# Altium schematic sheet LED_DRIVE.SchDoc
size A3; ApprovedBy: D. Grossman; CheckedBy: G. Engel; Author: Y. Yakov; CompanyName: LightSense; DrawnBy: Y. Yakov; Engineer: Y.Yakov; Organization: LightSense
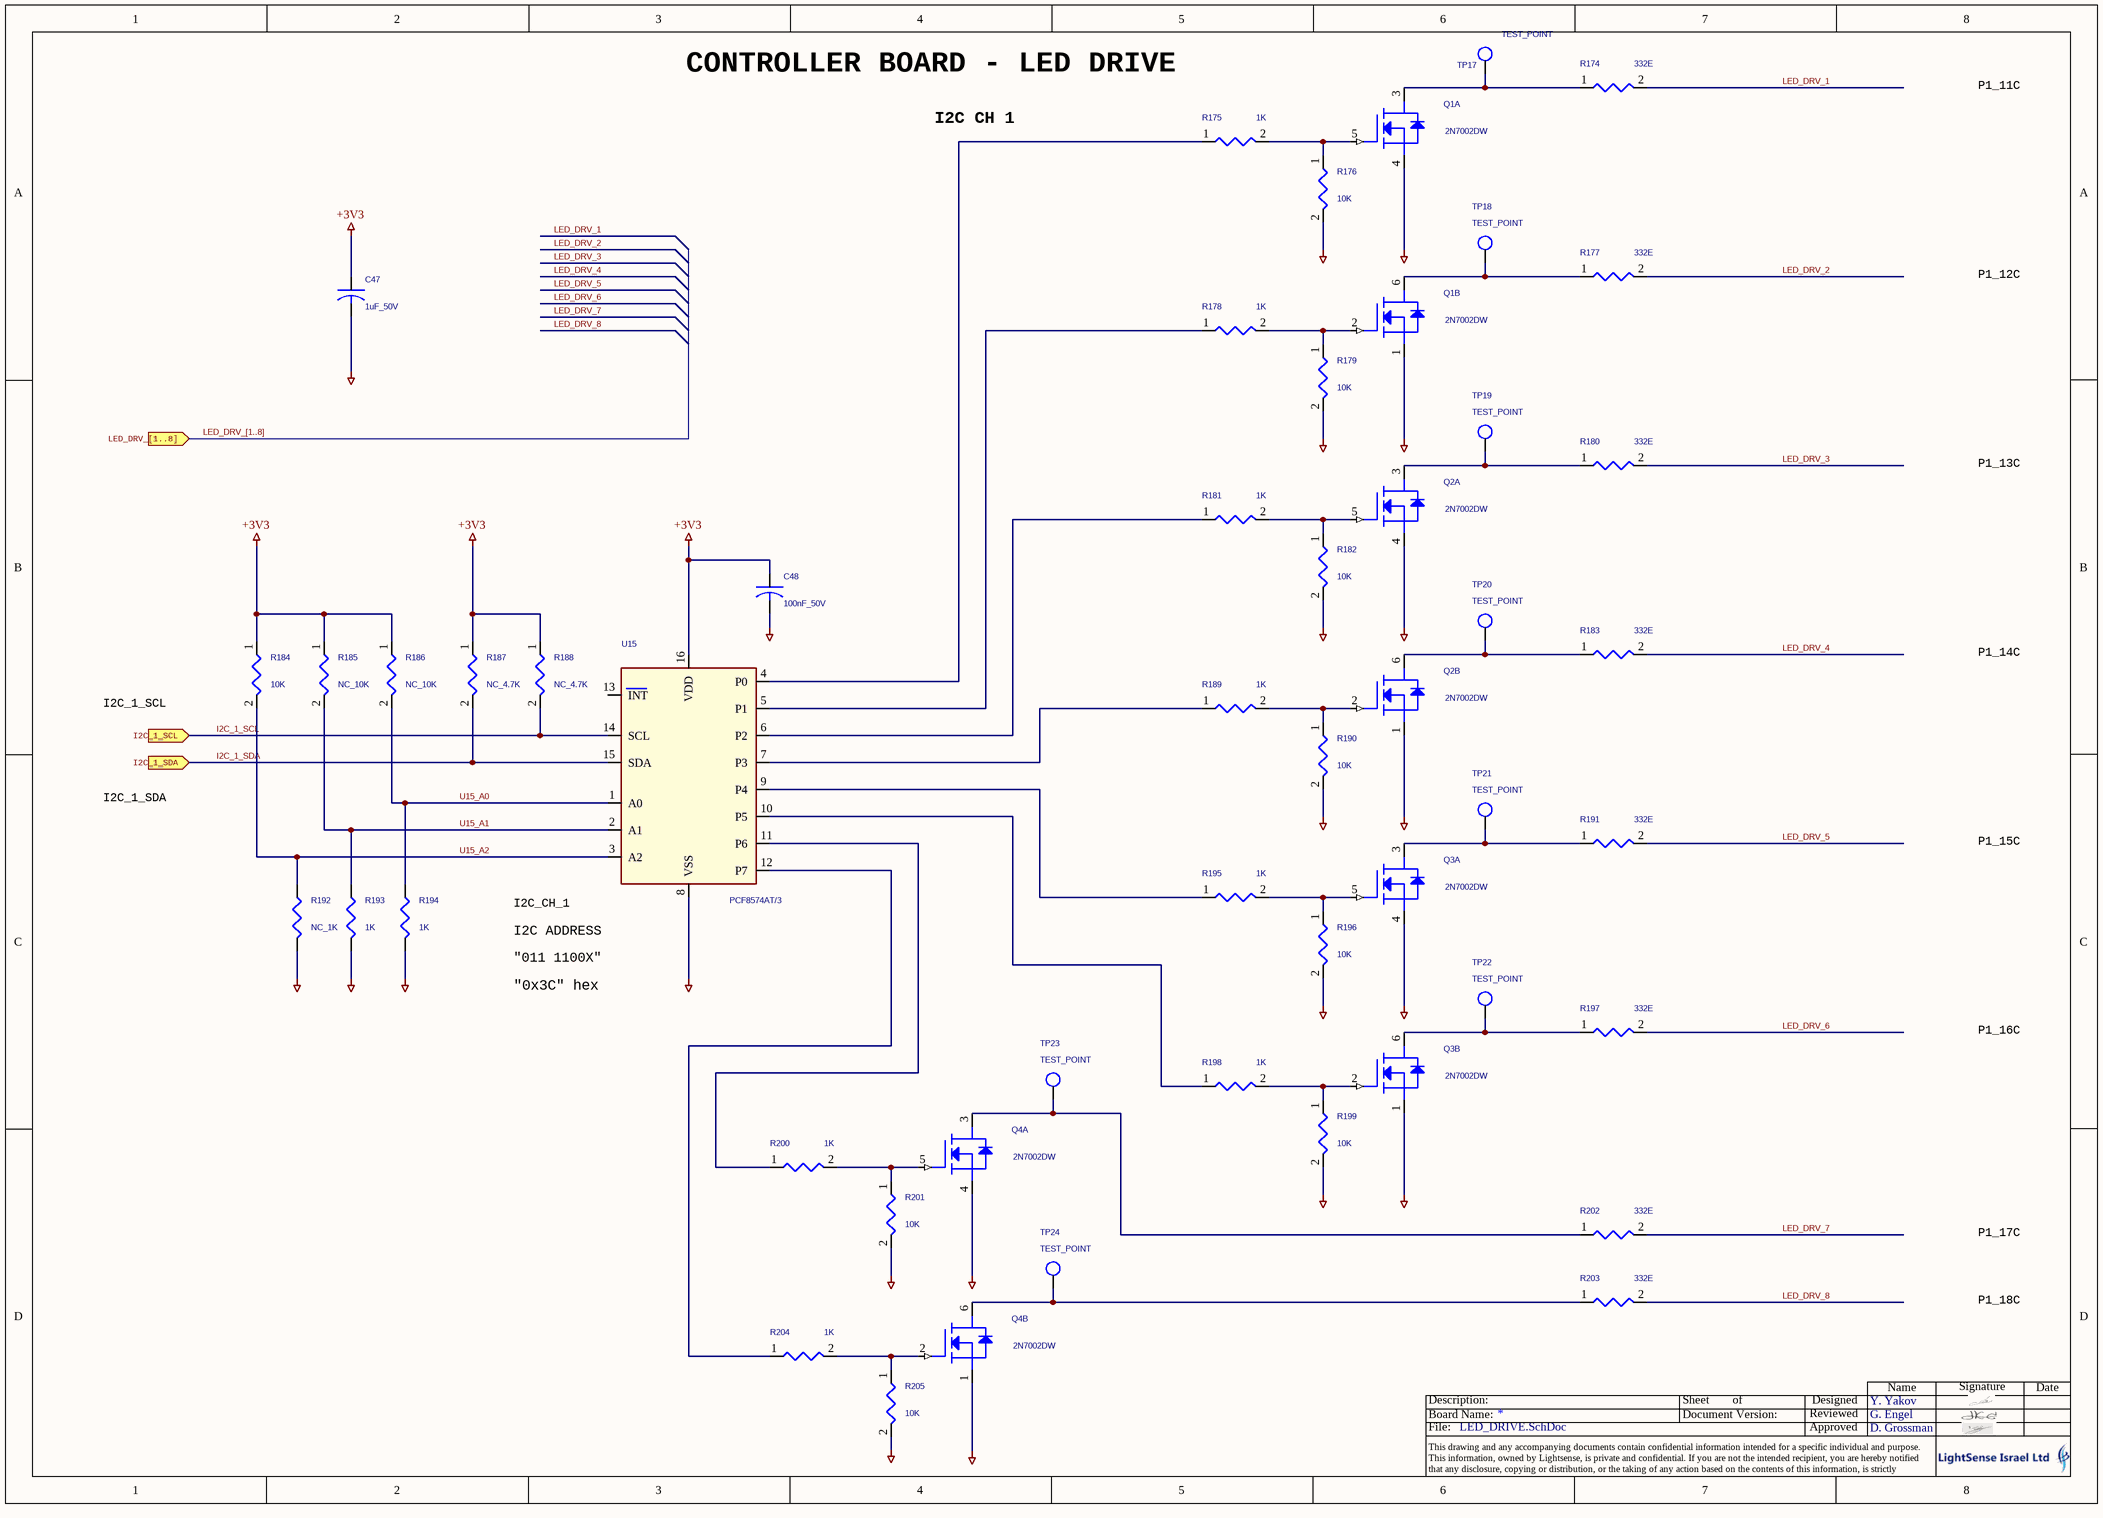
[diagram p0: LED_DRIVE.SchDoc]

## Parts
C47  1uF_50V  [0805]
C48  100nF_50V  [0603]
Q1  2N7002DW  [SOT_363]  (parts A,B of 2)
Q2  2N7002DW  [SOT_363]  (parts A,B of 2)
Q3  2N7002DW  [SOT_363]  (parts A,B of 2)
Q4  2N7002DW  [SOT_363]  (parts A,B of 2)
R174  332E  [R0603]
R175  1K  [R0603]
R176  10K  [R0603]
R177  332E  [R0603]
R178  1K  [R0603]
R179  10K  [R0603]
R180  332E  [R0603]
R181  1K  [R0603]
R182  10K  [R0603]
R183  332E  [R0603]
R184  10K  [R0603]
R185  NC_10K  [R0603]
R186  NC_10K  [R0603]
R187  NC_4.7K  [R0603]
R188  NC_4.7K  [R0603]
R189  1K  [R0603]
R190  10K  [R0603]
R191  332E  [R0603]
R192  NC_1K  [0603]
R193  1K  [0603]
R194  1K  [0603]
R195  1K  [R0603]
R196  10K  [R0603]
R197  332E  [R0603]
R198  1K  [R0603]
R199  10K  [R0603]
R200  1K  [R0603]
R201  10K  [R0603]
R202  332E  [R0603]
R203  332E  [R0603]
R204  1K  [R0603]
R205  10K  [R0603]
TP17  TEST_POINT  [TH_1mm]
TP18  TEST_POINT  [TH_1mm]
TP19  TEST_POINT  [TH_1mm]
TP20  TEST_POINT  [TH_1mm]
TP21  TEST_POINT  [TH_1mm]
TP22  TEST_POINT  [TH_1mm]
TP23  TEST_POINT  [TH_1mm]
TP24  TEST_POINT  [TH_1mm]
U15  PCF8574AT/3  [SO_16]

## Ports
I2C_1_SCL (in), I2C_1_SDA (in), LED_DRV_[1..8] (in)

## Nets
+3V3: C47.1 C48.1 R184.1 R185.1 R186.1 R187.1 R188.1 U15.16(VDD)
GND_CPU: C47.2 C48.2 Q1.1(SOURCE) Q1.4(SOURCE) Q2.1(SOURCE) Q2.4(SOURCE) Q3.1(SOURCE) Q3.4(SOURCE) Q4.1(SOURCE) Q4.4(SOURCE) R176.2 R179.2 R182.2 R190.2 R192.2 R193.2 R194.2 R196.2 R199.2 R201.2 R205.2 U15.8(VSS)
I2C_1_SCL: R188.2 U15.14(SCL) ; port I2C_1_SCL
I2C_1_SDA: R187.2 U15.15(SDA) ; port I2C_1_SDA
LED_DRV_1: R174.2
LED_DRV_2: R177.2
LED_DRV_3: R180.2
LED_DRV_4: R183.2
LED_DRV_5: R191.2
LED_DRV_6: R197.2
LED_DRV_7: R202.2
LED_DRV_8: R203.2
U15_A0: R186.2 R194.1 U15.1(A0)
U15_A1: R185.2 R193.1 U15.2(A1)
U15_A2: R184.2 R192.1 U15.3(A2)
NetQ1_2: Q1.2(GATE) R178.2 R179.1
NetQ1_3: Q1.3(DRAIN) R174.1 TP17.1(TP)
NetQ1_5: Q1.5(GATE) R175.2 R176.1
NetQ1_6: Q1.6(DRAIN) R177.1 TP18.1(TP)
NetQ2_2: Q2.2(GATE) R189.2 R190.1
NetQ2_3: Q2.3(DRAIN) R180.1 TP19.1(TP)
NetQ2_5: Q2.5(GATE) R181.2 R182.1
NetQ2_6: Q2.6(DRAIN) R183.1 TP20.1(TP)
NetQ3_2: Q3.2(GATE) R198.2 R199.1
NetQ3_3: Q3.3(DRAIN) R191.1 TP21.1(TP)
NetQ3_5: Q3.5(GATE) R195.2 R196.1
NetQ3_6: Q3.6(DRAIN) R197.1 TP22.1(TP)
NetQ4_2: Q4.2(GATE) R204.2 R205.1
NetQ4_3: Q4.3(DRAIN) R202.1 TP23.1(TP)
NetQ4_5: Q4.5(GATE) R200.2 R201.1
NetQ4_6: Q4.6(DRAIN) R203.1 TP24.1(TP)
NetR175_1: R175.1 U15.4(P0)
NetR178_1: R178.1 U15.5(P1)
NetR181_1: R181.1 U15.6(P2)
NetR189_1: R189.1 U15.7(P3)
NetR195_1: R195.1 U15.9(P4)
NetR198_1: R198.1 U15.10(P5)
NetR200_1: R200.1 U15.11(P6)
NetR204_1: R204.1 U15.12(P7)

Not connected (* = marked no-connect by the designer): U15 13(INT)

## Buses and harness runs
bus LED_DRV_[1..8] = port LED_DRV_[1..8]

## Notes on the sheet
- CONTROLLER BOARD - LED DRIVE
- P1_11C
- I2C CH 1
- P1_12C
- P1_13C
- I2C_1_SCL
- P1_14C
- I2C_1_SDA
- P1_15C
- I2C_CH_1
- (near U15) I2C ADDRESS
- "0x3C" hex
- "011 1100X"
- P1_16C
- P1_17C
- P1_18C
- Name
- Signature
- Date
- File:
- Board Name:
- Description:
- Document Version:
- Sheet
- of
- Approved
- Reviewed
- Designed
- This drawing and any accompanying documents contain confidential information intended for a specific individual and purpose.
  This information, owned by Lightsense, is private and confidential. If you are not the intended recipient, you are hereby notified that any disclosure, copying or distribution, or the taking of any action based on the contents of this information, is strictly prohibited.

## Library data of the parts
C47 = CAP: a; Mnfctr_Part_Number: TCJT106M016R0150; MFG: Murata; MFG_PN: GRM21BR60J106K
C48 = C: CAP_SMT_0603_50V_X7R_10%; MFG: KEMET; MFG_PN: C0603C104K5RAC
Q1-Q3 = 2N7002DW: MFG: DIODES; MFG_PN: 2N7002DW-7-F
Q4 = 2N7002DW: MFG_PN: 2N7002DW-7-F; MFG: DIODES
R174 R177 R180 R183 R191 R197 R202 R203 = R: MFG: YAGEO; MFG_PN: RC0603FR-07332RL
R175 R178 R181 R189 R195 R198 = R: MFG_PN: RC0603FR-071KL; MFG: YAGEO
R176 R179 R182 R184-R186 R188 R190 R196 R199 = R: MFG_PN: RC0603FR-0710KL; MFG: YAGEO
R187 R201 R205 = R: MFG: YAGEO; MFG_PN: RC0603FR-0710KL
R192 = R_Dup1: MFG_PN: RC0603FR-071K00L; MFG: YAGEO
R193 R194 = R_Dup1: MFG: YAGEO; MFG_PN: RC0603FR-071K00L
R200 R204 = R: MFG: YAGEO; MFG_PN: RC0603FR-071KL
TP17-TP22 = T POINT R: MFG_PN: N.A.; MFG: N.A.
TP23 TP24 = T POINT R: MFG: N.A.; MFG_PN: N.A.
U15 = PCF8574_0: PORT I2C, 8Bit, SO_16; MFG: NXP; MFG_PN: PCF8574AT/3